# Altium schematic sheet AutoProgramCircuit.SchDoc
size A4
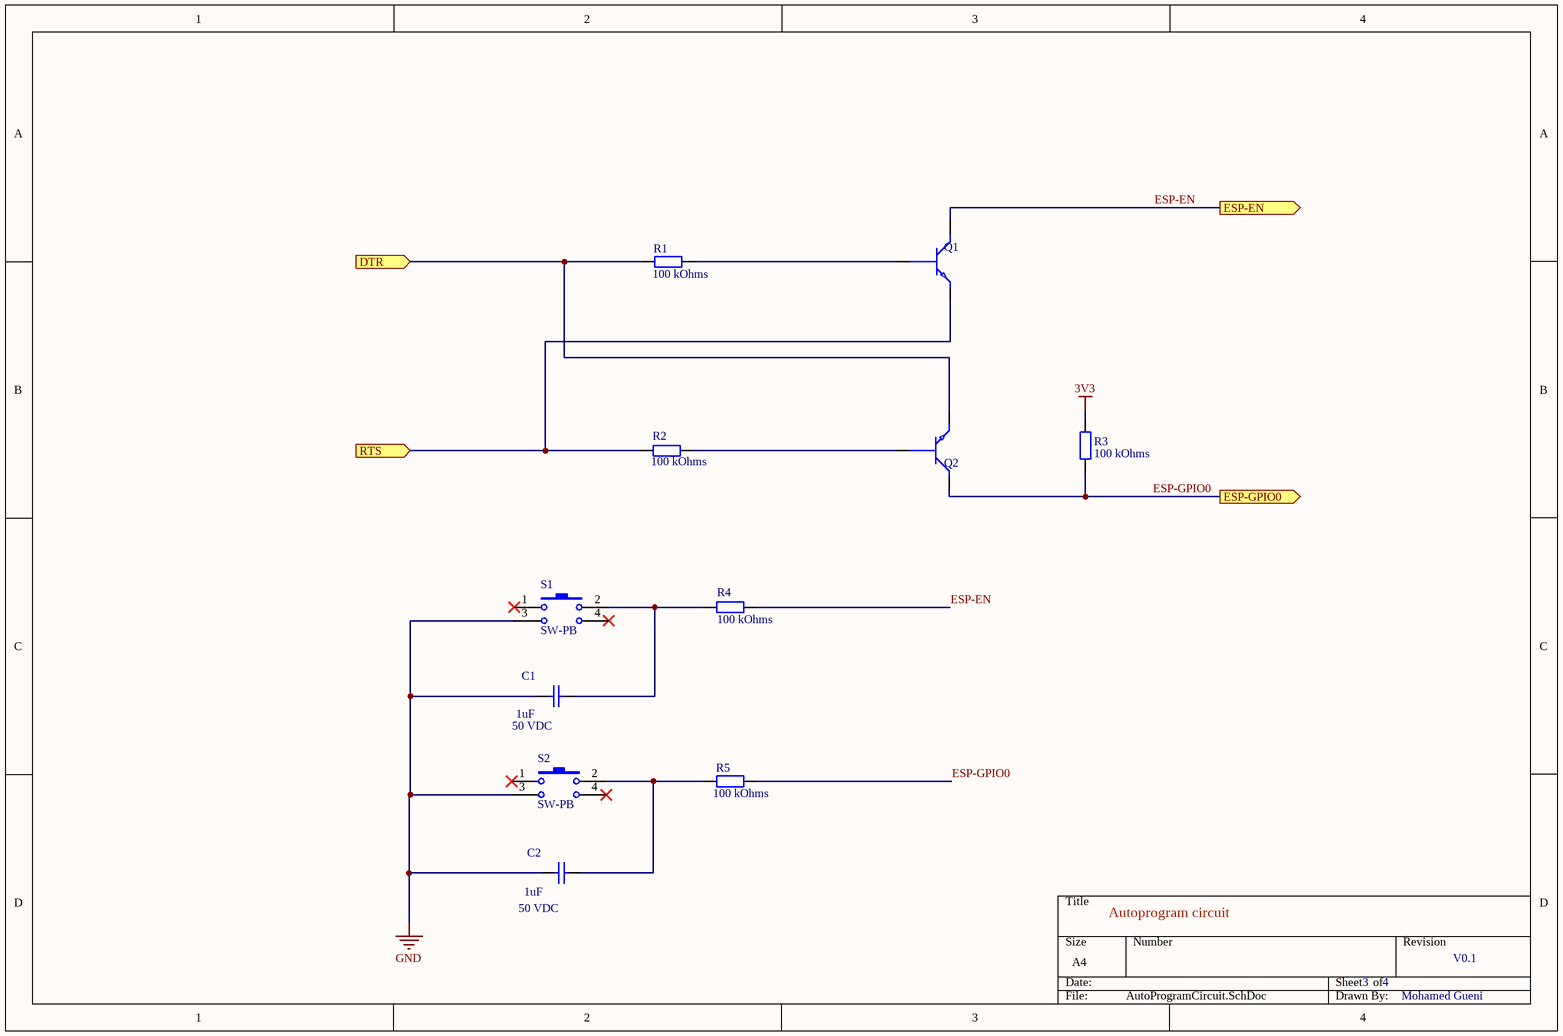
[diagram p0: AutoProgramCircuit.SchDoc]

## Parts
C1  Value 1: 1uF  Value 2: 50 VDC  [CAP-0603]  (hidden comment: Capacitor)
C2  Value 1: 1uF  Value 2: 50 VDC  [CAP-0603]  (hidden comment: Capacitor)
Q1  BJT  [SOT95P245X112-3N]  (value not drawn)
Q2  BJT  [SOT95P245X112-3N]  (value not drawn)
R1  Value 1: 100 kOhms  [R0603]  (hidden comment: Resistor)
R2  Value 1: 100 kOhms  [R0603]  (hidden comment: Resistor)
R3  Value 1: 100 kOhms  [R0603]  (hidden comment: Resistor)
R4  Value 1: 100 kOhms  [R0603]  (hidden comment: Resistor)
R5  Value 1: 100 kOhms  [R0603]  (hidden comment: Resistor)
S1  SW-PB  [SKHHDHA010]
S2  SW-PB  [SKHHDHA010]

## Ports
DTR (in), ESP-EN (out), ESP-GPIO0 (out), RTS (in)

## Nets
3V3: R3.2
GND: C1.1 C2.1 S1.3 S2.3
DTR: Q2.2(E) R1.1 ; port DTR
ESP-EN: Q1.3(C) R4.2 ; port ESP-EN
ESP-GPIO0: Q2.3(C) R3.1 R5.2 ; port ESP-GPIO0
RTS: Q1.2(E) R2.1 ; port RTS
NetC1_2: C1.2 R4.1 S1.2
NetC2_2: C2.2 R5.1 S2.2
NetQ1_1: Q1.1(B) R1.2
NetQ2_1: Q2.1(B) R2.2

Not connected (* = marked no-connect by the designer): S1 1* 4*; S2 1* 4*

## Notes on the sheet
- Autoprogram circuit
- 3
- 4
- V0.1
- Mohamed Gueni

## Library data of the parts
C1 C2 = C-000000011: DES: Multilayer Ceramic Capacitors MLCC - SMD/SMT Automotive Grade,MLCC,0603,X7R,50V,1uF,+/-10%,0.8mm; MAN: TDK; MANREF: CGA3E3X7R1H105K080AB; SUP: Mouser; SUPREF: 810-CGA3E3X7R1H105K0; TOL: 10%; FTP: 0603; NOTE: _; Part Number: C-000000011
Q1 Q2 = Q-000000003: DES: MMSS8050-H-TP; MAN: Bipolar Transistors - BJT 625mW, 25V, 1500mA; MANREF: Micro Commercial Components (MCC); SUP: 1.5 A; SUPREF: Bipolar; Value 1: Mouser; Value 2: 833-MMSS8050-H-TP; TOL: SOT-23-3; FTP: 5 V; NOTE: NPN; DataSheet: https://eu.mouser.com/datasheet/2/258/MMSS8050(SOT-23)-276387.pdf; Part Number: Q-000000003
R1-R5 = R-000000002: TOL: 1 %; DES: Thick Film Resistors - SMD 1/10watt 100Kohms 1%; MAN: Vishay; MANREF: CRCW0603100KFKEA; SUP: Mouser; SUPREF: 71-CRCW0603-100K-E3; Value 2: 100 mW; Part Number: R-000000002; FTP: R0603; NOTE: -
S1 S2 = SW-000000001: DES: Tactile Switches 50 mAmps at 12 Volts; MAN: ALPS / Gravitech / Gravitech; SUP: Mouser; SUPREF: 688-SKHHDHA010; N°: SW-000000001; MANREF: SKHHDHA010; Footprint: Through Hole; DataSheet: https://eu.mouser.com/datasheet/2/15/SKHH-1370651.pdf